# Altium schematic sheet STAC_Test_Board_v1_Power.SchDoc: STAC Power Supplies and Regulators
size B; DrawnBy: Rahul Kumar; Revision: X1; SheetNumber: 2; SheetTotal: 5
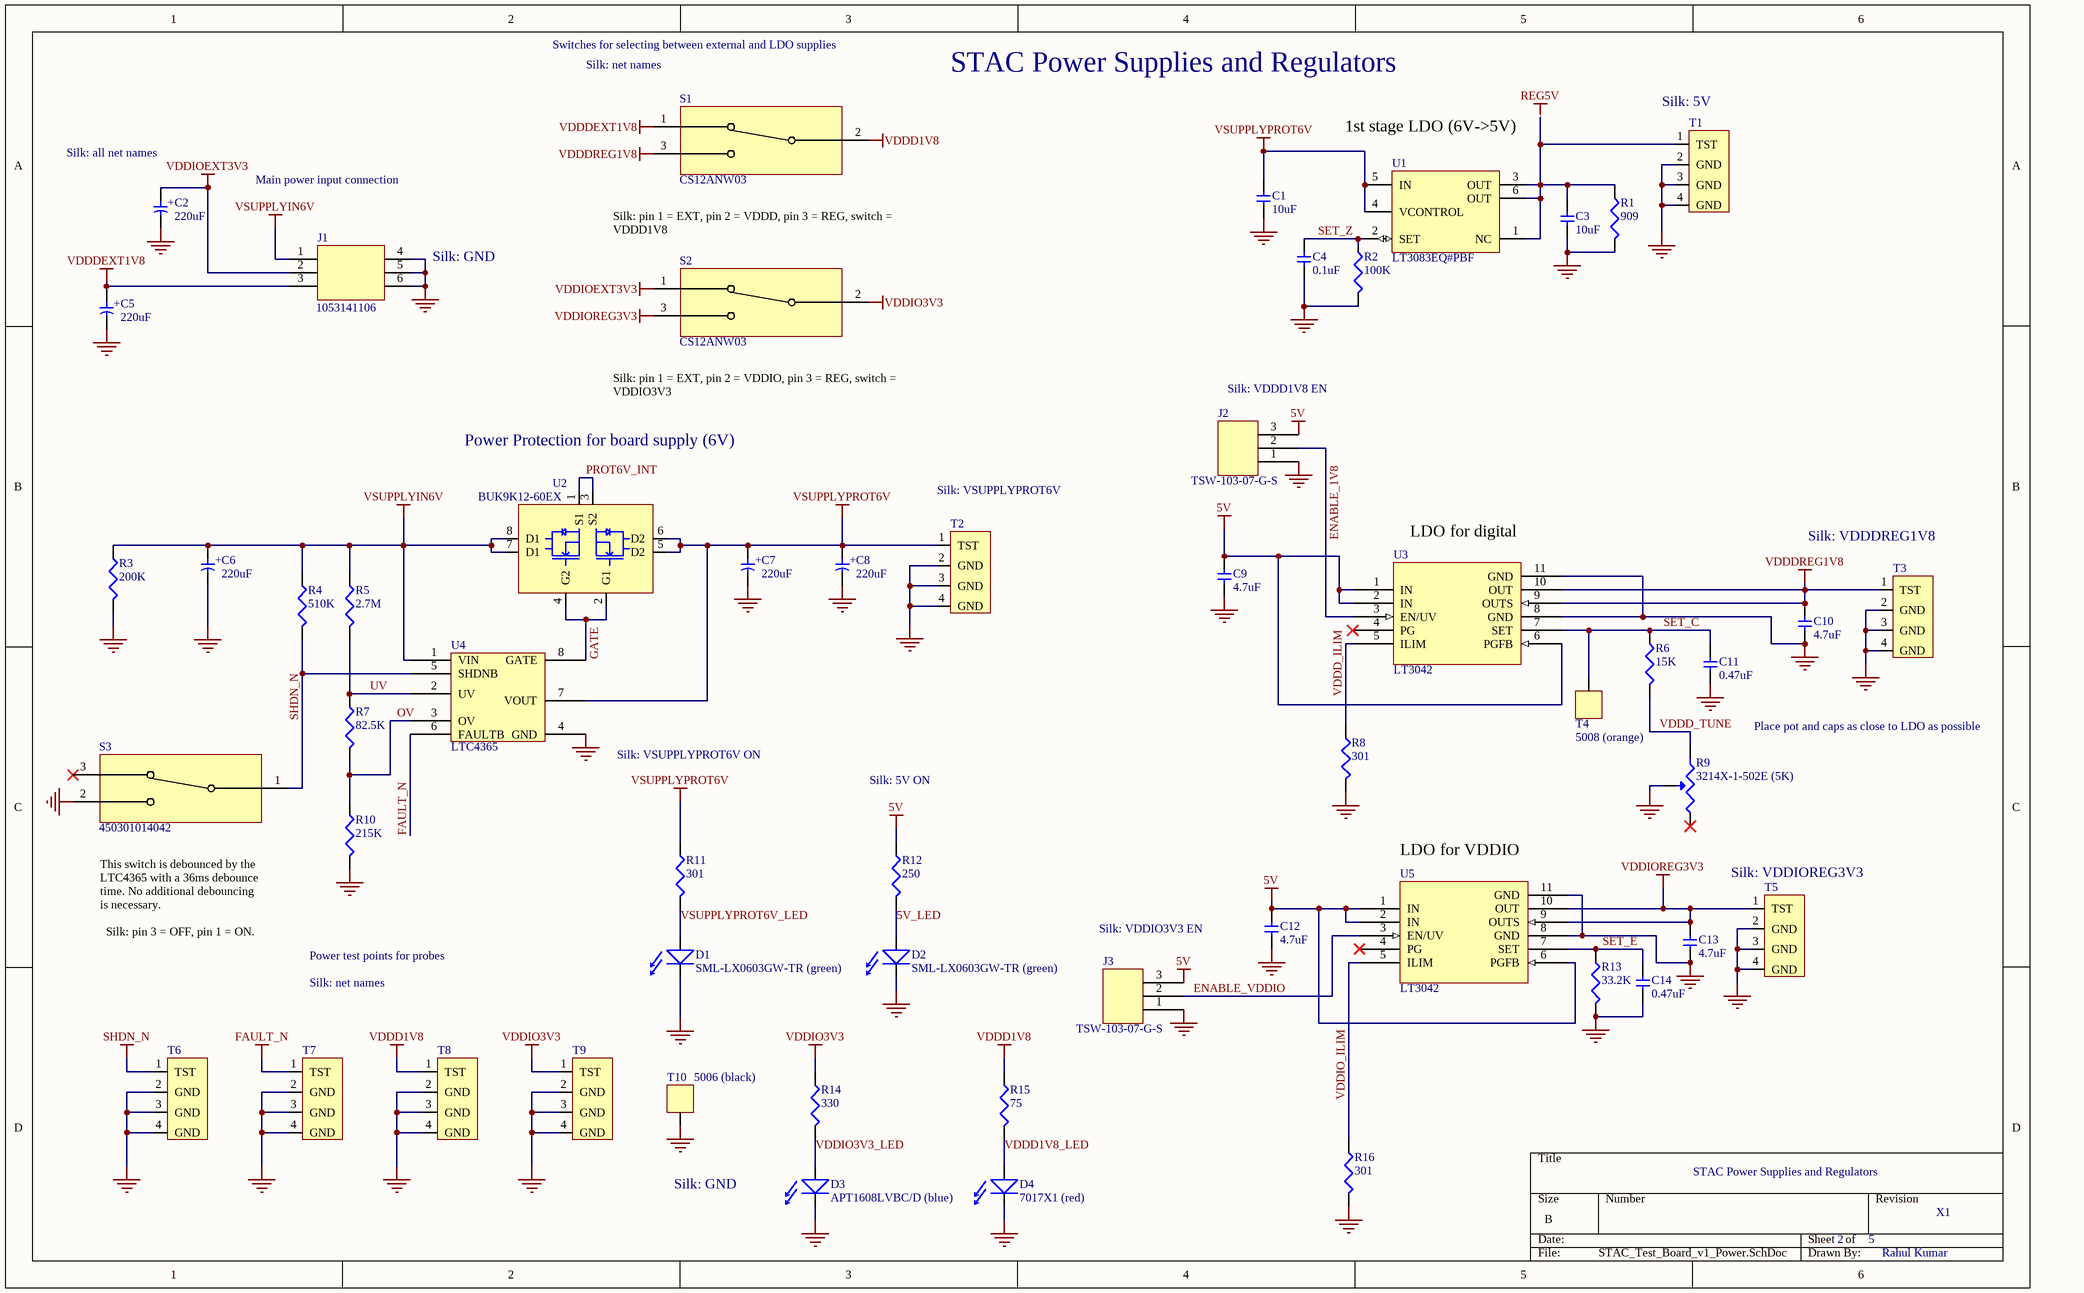
[diagram p0: STAC_Test_Board_v1_Power.SchDoc]

## Parts
C1  10uF  [0603]
C2  220uF  [CAP-SMT-CAN-D]
C3  10uF  [0603]
C4  0.1uF  [0603]
C5  220uF  [CAP-SMT-CAN-D]
C6  220uF  [CAP-SMT-CAN-D]
C7  220uF  [CAP-SMT-CAN-D]
C8  220uF  [CAP-SMT-CAN-D]
C9  4.7uF  [0603]
C10  4.7uF  [0603]
C11  0.47uF  [0603]
C12  4.7uF  [0603]
C13  4.7uF  [0603]
C14  0.47uF  [0603]
D1  SML-LX0603GW-TR (green)  [LED-0603]
D2  SML-LX0603GW-TR (green)  [LED-0603]
D3  APT1608LVBC/D (blue)  [LED-0603]
D4  7017X1 (red)  [LED-0603]
J1  1053141106  [CON-006-2.50-8.4X12.68/2X3-RA-POST]
J2  TSW-103-07-G-S  [CON-003-100-300X100/1X3-POST]
J3  TSW-103-07-G-S  [CON-003-100-300X100/1X3-POST]
R1  909  [0603]
R2  100K  [0603]
R3  200K  [0603]
R4  510K  [0603]
R5  2.7M  [0603]
R6  15K  [0603]
R7  82.5K  [0603]
R8  301  [0603]
R9  3214X-1-502E (5K)  [VR-03-100-4.8X5.7/TOP]
R10  215K  [0603]
R11  301  [0603]
R12  250  [0603]
R13  33.2K  [0603]
R14  330  [0603]
R15  75  [0603]
R16  301  [0603]
S1  CS12ANW03  [SW-003-4.7-14.0X7.0/SPDT-CS]
S2  CS12ANW03  [SW-003-4.7-14.0X7.0/SPDT-CS]
S3  450301014042  [SW-003-100-10.0X2.5/SPDT-WS-SLTV]
T1  TEST_PT_4  [TP-04-40/ROUND-THT]  (value not drawn)
T2  TEST_PT_4  [TP-04-40/ROUND-THT]  (value not drawn)
T3  TEST_PT_4  [TP-04-40/ROUND-THT]  (value not drawn)
T4  5008 (orange)  [TP-63/ROUND-THT]
T5  TEST_PT_4  [TP-04-40/ROUND-THT]  (value not drawn)
T6  TEST_PT_4  [TP-04-40/ROUND-THT]  (value not drawn)
T7  TEST_PT_4  [TP-04-40/ROUND-THT]  (value not drawn)
T8  TEST_PT_4  [TP-04-40/ROUND-THT]  (value not drawn)
T9  TEST_PT_4  [TP-04-40/ROUND-THT]  (value not drawn)
T10  5006 (black)  [TP-63/ROUND-THT]
U1  LT3083EQ#PBF  [TAB-05-10.2X14.2-Q-DDPAK]
U2  BUK9K12-60EX  [LCCT-08-1.27-5.3X6.2/DUAL-FET]
U3  LT3042  [GW-10-.5-4.9/THM]
U4  LTC4365  [GW-08-.65-2.9]
U5  LT3042  [GW-10-.5-4.9/THM]

## Nets
5V: C9.1 C12.1 J2.3 J3.3 R12.1 U3.1(IN) U3.2(IN) U3.6(PGFB) U5.1(IN) U5.2(IN) U5.6(PGFB)
FAULT_N: T7.1(TST) U4.6(FAULTB)
GND: C1.2 C2.2 C3.2 C4.2 C5.2 C6.2 C7.2 C8.2 C9.2 C10.2 C11.2 C12.2 C13.2 C14.2 D1.1 D2.1 D3.1 D4.1 J1.4 J1.5 J1.6 J2.1 J3.1 R1.2 R2.2 R3.2 R8.2 R9.2 R10.2 R13.2 R16.2 S3.2 T1.2(GND) T1.3(GND) T1.4(GND) T2.2(GND) T2.3(GND) T2.4(GND) T3.2(GND) T3.3(GND) T3.4(GND) T5.2(GND) T5.3(GND) T5.4(GND) T6.2(GND) T6.3(GND) T6.4(GND) T7.2(GND) T7.3(GND) T7.4(GND) T8.2(GND) T8.3(GND) T8.4(GND) T9.2(GND) T9.3(GND) T9.4(GND) T10.1 U3.8(GND) U3.11(GND) U4.4(GND) U5.8(GND) U5.11(GND)
REG5V: C3.1 R1.1 T1.1(TST) U1.1(NC) U1.3(OUT) U1.6(OUT)
SHDN_N: R4.2 S3.1 T6.1(TST) U4.5(SHDNB)
VDDD1V8: R15.1 S1.2 T8.1(TST)
VDDDEXT1V8: C5.1 J1.3 S1.1
VDDDREG1V8: C10.1 S1.3 T3.1(TST) U3.9(OUTS) U3.10(OUT)
VDDIO3V3: R14.1 S2.2 T9.1(TST)
VDDIOEXT3V3: C2.1 J1.2 S2.1
VDDIOREG3V3: C13.1 S2.3 T5.1(TST) U5.9(OUTS) U5.10(OUT)
VSUPPLYIN6V: C6.1 J1.1 R3.1 R4.1 R5.1 U2.7(D1) U2.8(D1) U4.1(VIN)
VSUPPLYPROT6V: C1.1 C7.1 C8.1 R11.1 T2.1(TST) U1.4(VCONTROL) U1.5(IN) U2.5(D2) U2.6(D2) U4.7(VOUT)
5V_LED: D2.2 R12.2
ENABLE_1V8: J2.2 U3.3(EN/UV)
ENABLE_VDDIO: J3.2 U5.3(EN/UV)
GATE: U2.2(G1) U2.4(G2) U4.8(GATE)
OV: R7.2 R10.1 U4.3(OV)
PROT6V_INT: U2.1(S1) U2.3(S2)
SET_C: C11.1 R6.1 T4.1 U3.7(SET)
SET_E: C14.1 R13.1 U5.7(SET)
SET_Z: C4.1 R2.1 U1.2(SET)
UV: R5.2 R7.1 U4.2(UV)
VDDD1V8_LED: D4.2 R15.2
VDDD_ILIM: R8.1 U3.5(ILIM)
VDDD_TUNE: R6.2 R9.3
VDDIO3V3_LED: D3.2 R14.2
VDDIO_ILIM: R16.1 U5.5(ILIM)
VSUPPLYPROT6V_LED: D1.2 R11.2

Not connected (* = marked no-connect by the designer): R9 1*; S3 3*; U3 4(PG)*; U5 4(PG)*

## Notes on the sheet
- Switches for selecting between external and LDO supplies
- Silk: net names
- (near C2) Silk: all net names
- (near U1) 1st stage LDO (6V->5V)
- (near T1) Silk: 5V
- Main power input connection
- (near J1) Silk: GND
- Silk: pin 1 = EXT, pin 2 = VDDD, pin 3 = REG, switch = VDDD1V8
- Silk: pin 1 = EXT, pin 2 = VDDIO, pin 3 = REG, switch = VDDIO3V3
- (near J2) Silk: VDDD1V8 EN
- Power Protection for board supply (6V)
- (near T2) Silk: VSUPPLYPROT6V
- (near U3) LDO for digital
- (near T3) Silk: VDDDREG1V8
- Silk: VSUPPLYPROT6V ON
- Place pot and caps as close to LDO as possible
- Silk: 5V ON
- This switch is debounced by the LTC4365 with a 36ms debounce time. No additional debouncing is necessary.
- (near U5) LDO for VDDIO
- (near T5) Silk: VDDIOREG3V3
- Silk: pin 3 = OFF, pin 1 = ON.
- Power test points for probes
- Silk: VDDIO3V3 EN
- Silk: GND
- (in symbol DISCRETE_C_POL) +

## Library data of the parts
C1 C3 C4 C9-C14 = DISCRETE_C: Capacitor generic
C2 C5-C8 = DISCRETE_C_POL: 20% 16V Alum Radial SMD
D1-D4 = DISCRETE_LED: LED generic
J1 = CON_006pin_2x3_alt: Con 6 pins 2x3
J2 J3 = CON_003pin_1x3: Con 3 pins
R1-R8 R10-R16 = DISCRETE_R: Resistor generic
R9 = DISCRETE_R_VARIABLE: Potentiometer
S1 S2 = SWITCH_SPDT_3pin: SWITCH SLIDE SPDT
S3 = SWITCH_SPDT_3pin_alt: SWITCH SLIDE SPDT alternative symbol
T1-T3 T5-T9 = TEST_PT_4: Test point 4 pads for probing
T4 T10 = TEST_PT: Test point 1 pin
U1 = IC_LT3083: 3 A Single Resistor LDO 1.2 to 23 V Vin, Adj Vout
U2 = IC_BUK9K12-60EX: Dual channel NMOS FETs
U3 U5 = IC_LT3042: LT3042 ultralow noise, high PSRR LDO, max current 200mA
U4 = IC_LTC4365: LTC4365 Over/Under Voltage, Reverse Supply Protection Controller